# EAGLE design HW2 (EAGLE 7.5.0)
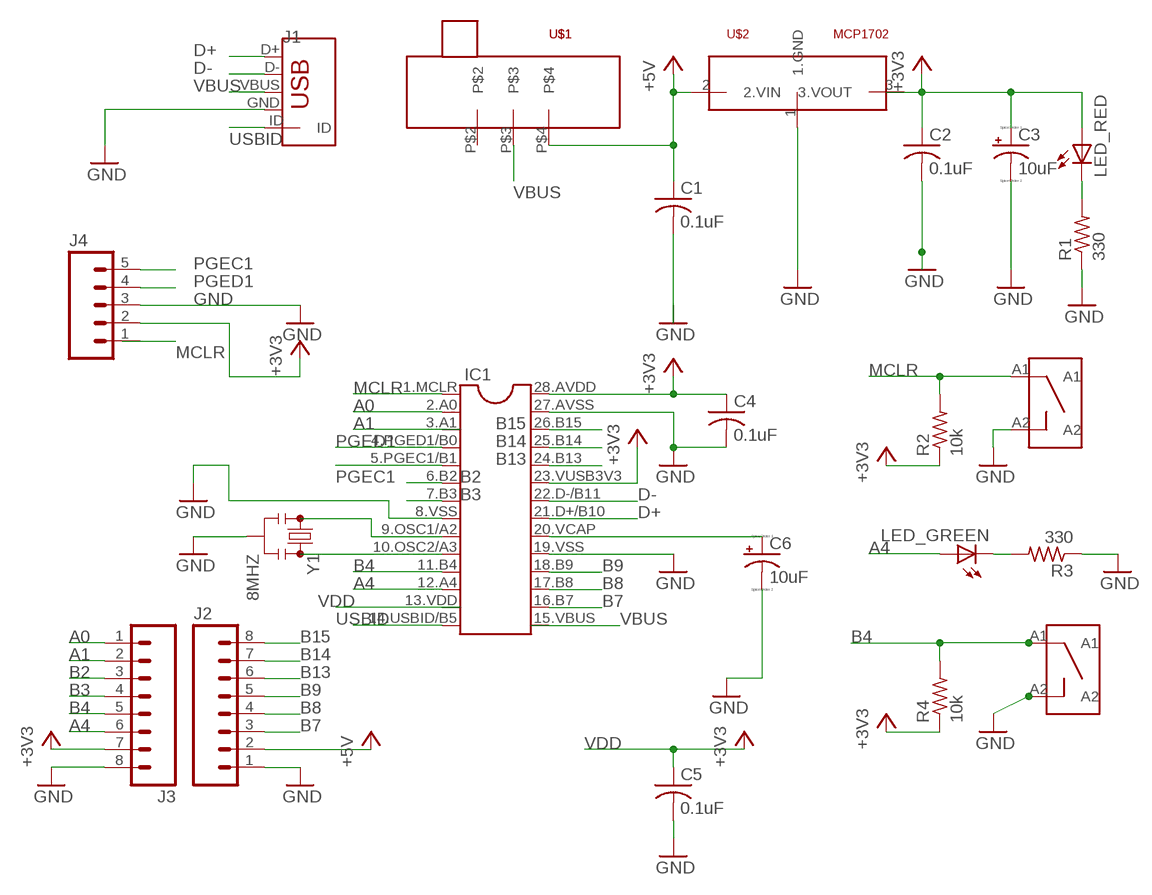
[diagram p0: schematic, sheet 1]

## Parts
C1  0.1uF  C-US025-024X044  [C025-024X044]
C2  0.1uF  C-US025-024X044  [C025-024X044]
C3  10uF  CPOL-USB45181A  [B45181A]
C4  0.1uF  C-US025-024X044  [C025-024X044]
C5  0.1uF  C-US025-024X044  [C025-024X044]
C6  10uF  CPOL-USB45181A  [B45181A]
IC1  DIL28-3  [DIL28-3]
J1  USB-MB-H  [USB-MB-H]
J2  M08  [1X08_ROUND]
J3  M08  [1X08_ROUND]
J4  M05PTH  [1X05]
LED_GREEN  LED3MM  [LED3MM]
LED_RED  LED3MM  [LED3MM]
R1  330  R-US_0207/10  [0207/10]
R2  10k  R-US_0207/10  [0207/10]
R3  330  R-US_0207/10  [0207/10]
R4  10k  R-US_0207/10  [0207/10]
U$1  SLIDE_SWITCH  [SLIDE_SWITCH]
U$2  MCP1702  [TO92]
U$4  PUSH_BUTTON  [RDT1034]
U$5  PUSH_BUTTON  [RDT1034]
Y1  8MHZ  RESONATORPTH  [RESONATOR-PTH]

## Nets
+3V3: C2.1 C3.+ C4.1 IC1.23.VUSB3V3 IC1.28.AVDD J3.7 J4.2 LED_RED.A R2.1 R4.1
+5V: C1.1 J2.2 U$1.P$4 U$2.2(2.VIN)
A0: IC1.2.A0 J3.1
A1: J3.2
A4: IC1.12.A4 J3.6 LED_GREEN.A
B2: IC1.6.B2 J3.3
B3: IC1.7.B3 J3.4
B4: IC1.11.B4 J3.5 R4.2 U$4.A1
B7: IC1.16.B7 J2.3
B8: IC1.17.B8 J2.4
B9: IC1.18.B9 J2.5
B13: IC1.24.B13 J2.6
B14: IC1.25.B14 J2.7
B15: IC1.26.B15 J2.8
D+: IC1.21.D+/B10 J1.D+
D-: IC1.22.D-/B11 J1.D-
GND: C2.2 C3.- C4.2 C5.2 C6.- IC1.8.VSS IC1.19.VSS IC1.27.AVSS J1.GND J2.1 J3.8 J4.3 R1.1 R3.1 U$2.1(1.GND) U$4.A2 U$5.A2 Y1.2
MCLR: IC1.1.MCLR R2.2 U$5.A1
N$1: LED_GREEN.K(C) R3.2
N$2: IC1.9.OSC1/A2 Y1.1
N$4: LED_RED.K(C) R1.2
N$5: IC1.10.OSC2/A3 Y1.3
N$6: C1.2
N$7: C6.+ IC1.20.VCAP
PGEC1: IC1.5.PGEC1/B1 J4.5
PGED1: IC1.4.PGED1/B0 J4.4
USBID: IC1.14.USBID/B5 J1.ID
VBUS: J1.VBUS U$1.P$3
VDD: C5.1 ; supply symbol labelled +3V3
Unconnected: IC1.3.A1 IC1.13.VDD IC1.15.VBUS J4.1 U$1.P$2 U$2.3(3.VOUT)

## Library data of the parts
C1 C2 C4 C5 = HW2:C-US: CAPACITOR, American symbol
C3 C6 = HW2:CPOL-US: POLARIZED CAPACITOR, American symbol
IC1 = HW2:DIL28: Dual In Line
J1 = HW2:USB: USB Connectors USB-B-PTH is fully proven SKU : PRT-00139/CONN-08278 USB-miniB is fully proven SKU : PRT-00587 USB-A-PCB is untested. USB-A-H is throughly reviewed, but untested. Spark Fun Electronics SKU : PRT-00437 USB-B-SMT is throughly reviewed, but untested. Needs silkscreen touching up. USB-A-S has not been used/tested USB-MB-H has not been used/tested USB-MICROB has been used. CONN-09505
J2 J3 = HW2:M08: Header 8 Standard 8-pin 0.1" header. Use with straight break away headers (SKU : PRT-00116), right angle break away headers (PRT-00553), swiss pins (PRT-00743), machine pins (PRT-00117), and female headers (PRT-00115).; PROD_ID: CONN-08437
J4 = HW2:M05: Header 5 Standard 5-pin 0.1" header. Use with straight break away headers (SKU : PRT-00116), right angle break away headers (PRT-00553), swiss pins (PRT-00743), machine pins (PRT-00117), and female headers (PRT-00115). Molex polarized connector foot print use with SKU : PRT-08230 with associated crimp pins and housings.
LED_GREEN LED_RED = HW2:LED: LED OSRAM: - CHIPLED LG R971, LG N971, LY N971, LG Q971, LY Q971, LO R971, LY R971 LH N974, LH R974 LS Q976, LO Q976, LY Q976 LO Q996 - Hyper CHIPLED LW Q18S LB Q993, LB Q99A, LB R99A - SideLED LS A670, LO A670, LY A670, LG A670, LP A670 LB A673, LV A673, LT A673, LW A673 LH A674 LY A675 LS A676, LA A676, LO A676, LY A676, LW A676 LS A679, LY A679, LG A679 - Hyper Micro SIDELED® LS Y876, LA Y876, LO Y876, LY Y876 LT Y87S - SmartLED LW L88C, LW L88S LB L89C, LB L89S, LG L890 LS L89K, LO L89K, LY L89K LS L896, LA L896, LO L896, LY L896 - TOPLED LS T670, LO T670, LY T670, LG T670, LP T670 LSG T670, LSP T670, LSY T670, LOP T670, LYG T670 LG T671, LOG T671, LSG T671 LB T673, LV T673, LT T673, LW T673 LH T674 LS T676, LA T676, LO T676, LY T676, LB T676, LH T676, LSB T676, LW T676 LB T67C, LV T67C, LT T67C, LS T67K, LO T67K, LY T67K, LW E67C LS E67B, LA E67B, LO E67B, LY E67B, LB E67C, LV E67C, LT E67C LW T67C LS T679, LY T679, LG T679 LS T770, LO T770, LY T770, LG T770, LP T770 LB T773, LV T773, LT T773, LW T773 LH T774 LS E675, LA E675, LY E675, LS T675 LS T776, LA T776, LO T776, LY T776, LB T776 LHGB T686 LT T68C, LB T68C - Hyper Mini TOPLED® LB M676 - Mini TOPLED Santana® LG M470 LS M47K, LO M47K, LY M47K Source: http://www.osram.convergy.de LUXEON: - LUMILED® LXK2-PW12-R00, LXK2-PW12-S00, LXK2-PW14-U00, LXK2-PW14-V00 LXK2-PM12-R00, LXK2-PM12-S00, LXK2-PM14-U00 LXK2-PE12-Q00, LXK2-PE12-R00, LXK2-PE12-S00, LXK2-PE14-T00, LXK2-PE14-U00 LXK2-PB12-K00, LXK2-PB12-L00, LXK2-PB12-M00, LXK2-PB14-N00, LXK2-PB14-P00, LXK2-PB14-Q00 LXK2-PR12-L00, LXK2-PR12-M00, LXK2-PR14-Q00, LXK2-PR14-R00 LXK2-PD12-Q00, LXK2-PD12-R00, LXK2-PD12-S00 LXK2-PH12-R00, LXK2-PH12-S00 LXK2-PL12-P00, LXK2-PL12-Q00, LXK2-PL12-R00 Source: www.luxeon.com KINGBRIGHT: KA-3528ASYC Source: www.kingbright.com
R1-R4 = HW2:R-US_: RESISTOR, American symbol
U$1 = HW2:SLIDE_SWITCH
U$2 = HW2:MCP1702
U$4 U$5 = HW2:PUSH_BUTTON
Y1 = HW2:RESONATOR: Resonator Small SMD resonator. Used, eg, on the Arduino Pro/ Pro Mini boards. 8MHz- XTAL-08895 16MHz- XTAL-08900

## Board
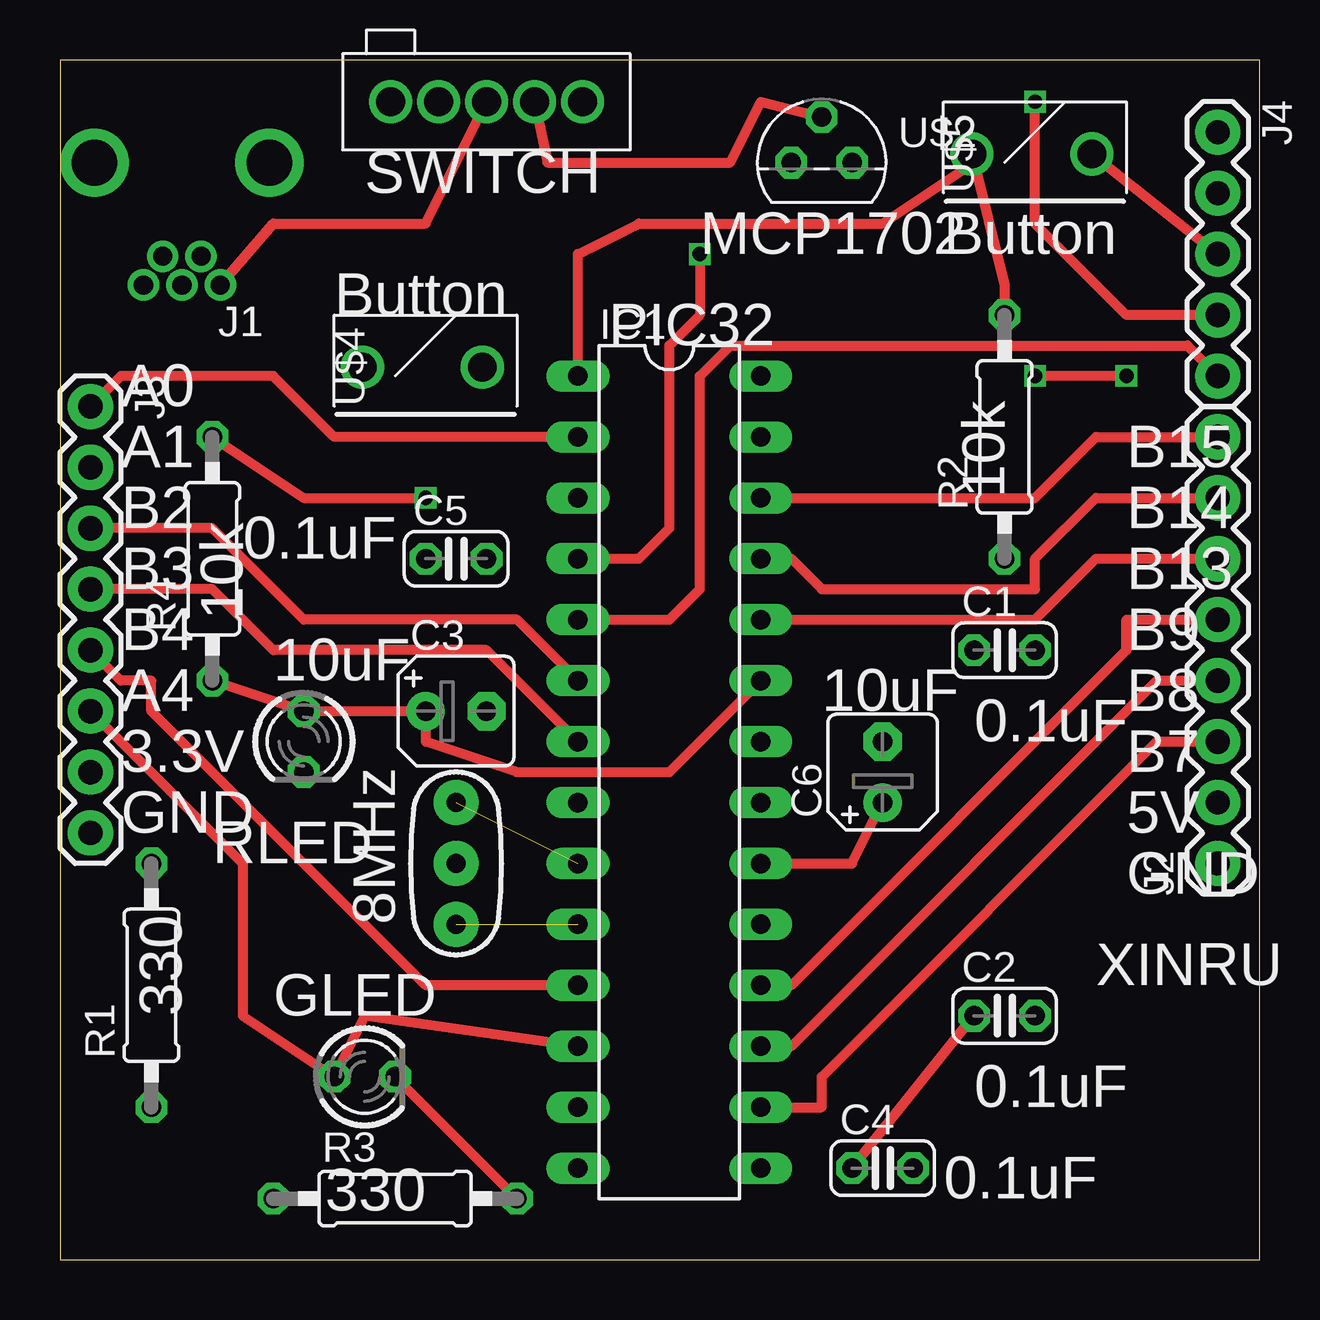
[diagram p1: board, top side]
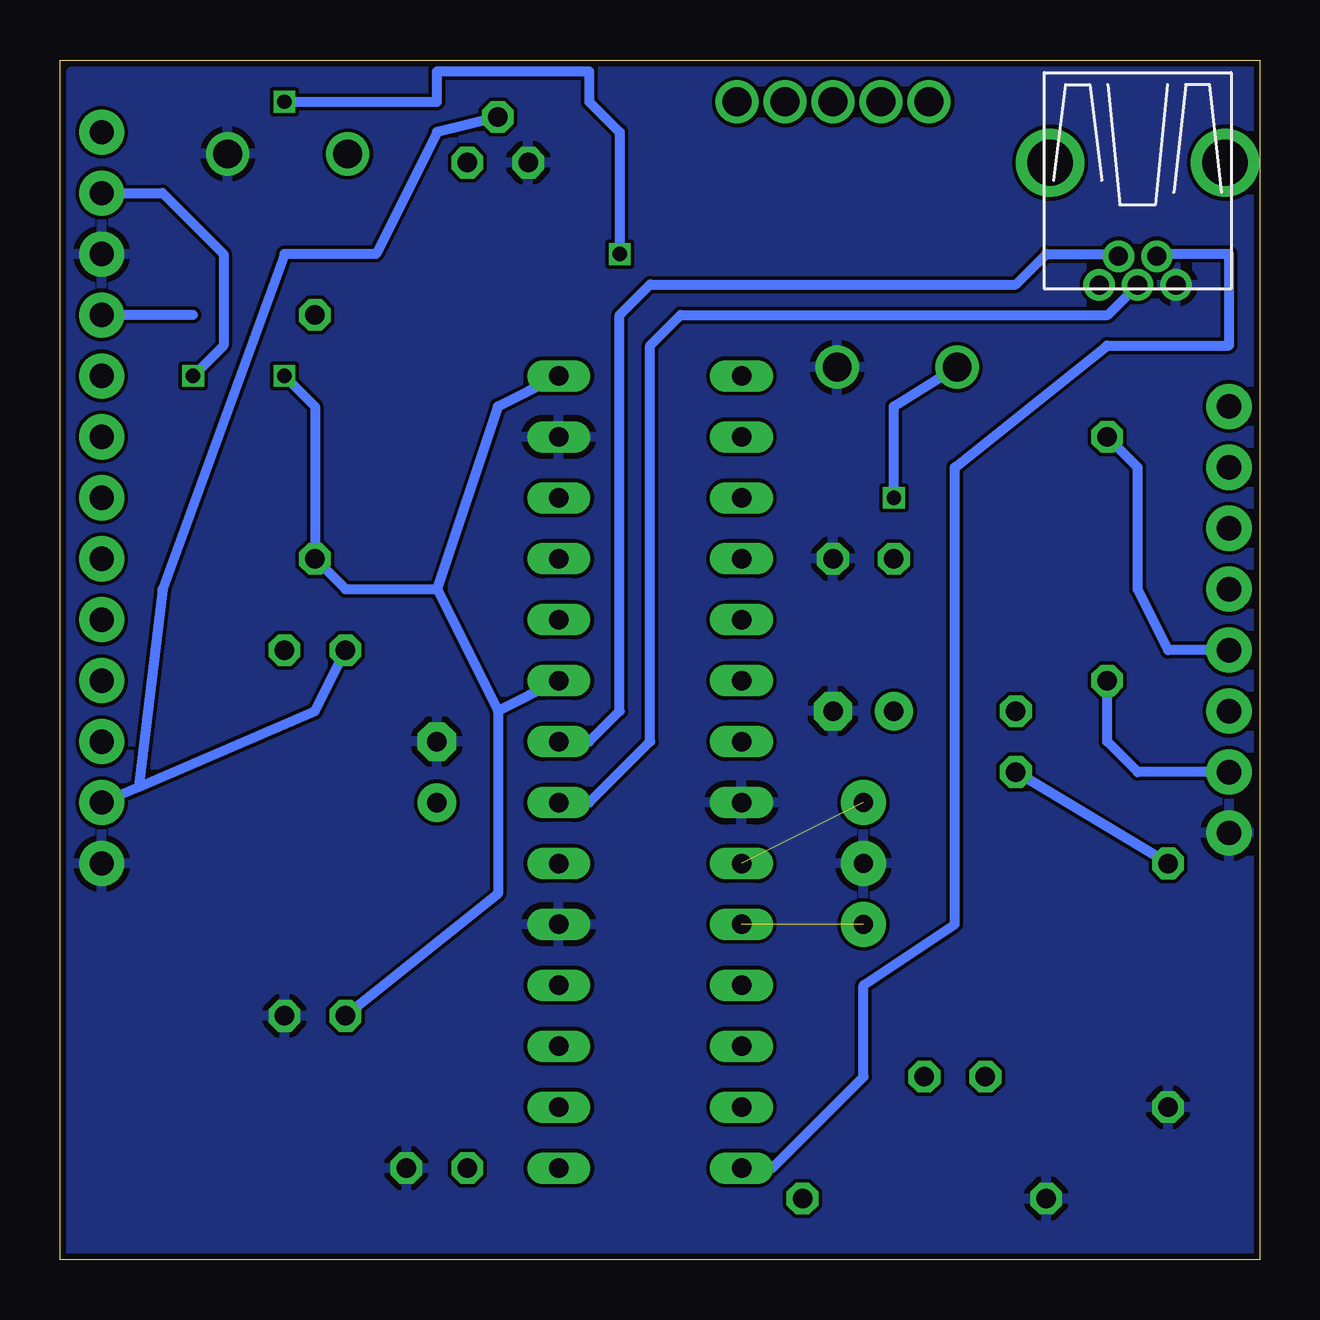
[diagram p2: board, bottom side, seen from below]

Size 50 x 50 mm. Coordinates in mm from the lower left corner, seen from the top.
Outline: 0,0 50,0 50,50 0,50 0,0
Copper layers (1*16): Top 0.035mm / dielectric 1.5mm / Bottom 0.035mm
Design rules "SeeedStudio_2layer_DRU_no_angle_20140221": minimum track width 6mil, minimum drill 12mil, track to track 6mil, track to pad 6mil, pad to pad 6mil, via to via 6mil, smd to smd 0mil, copper to edge 10mil, drill to drill 10mil, minimum pad ring 10mil, minimum via ring 6mil, stop-mask expansion 2mil, vias tented up to drill 100mil, thermal gap 10mil

### Footprints (pad centres in the part's own frame; a part is rotated, then mirrored left to right if it is on the bottom)
C025-024X044 = drill 0.813 octagon: 1 -1.27,0; 2 1.27,0
B45181A = drill 0.813 pad 1.6: + -1.27,0 | drill 0.813 pad 1.6 octagon: - 1.27,0
DIL28-3 = drill 0.813 long: 1.MCLR -16.51,-3.81; 2.A0 -13.97,-3.81; 3.A1 -11.43,-3.81; 4.PGED1/B0 -8.89,-3.81; 5.PGEC1/B1 -6.35,-3.81; 6.B2 -3.81,-3.81; 7.B3 -1.27,-3.81; 8.VSS 1.27,-3.81; 9.OSC1/A2 3.81,-3.81; 10.OSC2/A3 6.35,-3.81; 11.B4 8.89,-3.81; 12.A4 11.43,-3.81; 13.VDD 13.97,-3.81; 14.USBID/B5 16.51,-3.81; 15.VBUS 16.51,3.81; 16.B7 13.97,3.81; 17.B8 11.43,3.81; 18.B9 8.89,3.81; 19.VSS 6.35,3.81; 20.VCAP 3.81,3.81; 21.D+/B10 1.27,3.81; 22.D-/B11 -1.27,3.81; 23.VUSB3V3 -3.81,3.81; 24.B13 -6.35,3.81; 25.B14 -8.89,3.81; 26.B15 -11.43,3.81; 27.AVSS -13.97,3.81; 28.AVDD -16.51,3.81
USB-MB-H = drill 0.8: D+ 5.1,0; D- 3.9,0.8; GND 5.1,-1.6; ID 3.9,-0.8; VBUS 5.1,1.6 | drill 1.9: P$6 0,-3.65; P$7 0,3.65
1X08_ROUND = drill 1.016 pad 1.88: 1 0,0; 2 2.54,0; 3 5.08,0; 4 7.62,0; 5 10.16,0; 6 12.7,0; 7 15.24,0; 8 17.78,0
1X05 = drill 1.016 pad 1.88: 1 0,0; 2 2.54,0; 3 5.08,0; 4 7.62,0; 5 10.16,0
LED3MM = drill 0.813 octagon: A -1.27,0; K 1.27,0
0207/10 = drill 0.813 octagon: 1 -5.08,0; 2 5.08,0
SLIDE_SWITCH = drill 1.2: P$1 -4,0; P$2 -2,0; P$3 0,0; P$4 2,0; P$5 4,0
TO92 = drill 0.813 octagon: 1 -1.27,0; 2 0,1.905; 3 1.27,0
RDT1034 = drill 1.2: A1 -2.175,2.635; A2 -2.175,-2.365
RESONATOR-PTH = drill 0.8 pad 1.88: 1 -2.54,0; 2 0,0; 3 2.54,0

### Placement (x,y rotation side)
C1  39.37,25.4 0 top
C2  39.37,10.16 0 top
C3  16.51,22.86 0 top
C4  34.29,3.81 0 top
C5  16.51,29.21 0 top
C6  34.29,20.32 90 top
IC1  25.4,20.32 270 top
J1  5.08,45.72 270 top
J2  48.26,16.51 90 top
J3  1.27,35.56 270 top
J4  48.26,46.99 270 top
LED_GREEN  12.7,7.62 0 top
LED_RED  10.16,21.59 270 top
R1  3.81,11.43 90 top
R2  39.37,34.29 90 top
R3  13.97,2.54 0 top
R4  6.35,29.21 90 top
U$1  17.78,48.26 0 top
U$2  31.75,45.72 0 top
U$4  15.24,39.37 90 top
U$5  40.64,48.26 90 top
Y1  16.51,16.51 270 top

### Tracks (layer width: path | path; a pad name or v marks a point on that pad's centre or on a via)
+3V3  (via drill 0.6)
  Top 0.406: R4.1 LED_RED.A C3.+ 15.24,21.59 19.05,20.32 25.4,20.32 IC1.23.VUSB3V3 | C4.1 C2.1 | v44.45,36.83 v40.64,36.83
  Bottom 0.406: J3.7 5.08,20.32 6.35,21.59 R4.1 | IC1.23.VUSB3V3 31.75,22.86 | 31.75,22.86 31.75,15.24 C2.1 | 34.29,27.94 38.1,27.94 R2.1 39.37,35.56 v40.64,36.83 | 34.29,27.94 31.75,22.86 | IC1.28.AVDD 31.75,35.56 34.29,27.94 | J4.2 45.72,44.45 43.18,41.91 43.18,38.1 v44.45,36.83
+5V
  Top 0.406: U$1.P$4 20.32,45.72 27.94,45.72 29.21,48.26 U$2.2
  Bottom 0.406: J2.2 46.73,19.71 | 46.73,19.71 39.37,22.86 C1.1 | U$2.2 34.29,46.99 36.83,41.91 40.64,41.91 45.72,27.94 46.73,19.71
A0
  Top 0.406: IC1.2.A0 11.43,34.29 8.89,36.83 2.54,36.83 J3.1
A4
  Top 0.406: J3.6 7.62,16.51 7.62,10.16 LED_GREEN.A 12.7,10.16 IC1.12.A4
B2
  Top 0.406: IC1.6.B2 19.05,26.67 10.16,26.67 6.35,30.48 J3.3
B3
  Top 0.406: IC1.7.B3 17.78,25.4 8.89,25.4 6.35,27.94 J3.4
B4  (via drill 0.6)
  Top 0.406: IC1.11.B4 15.24,11.43 3.81,22.86 3.81,24.13 2.54,24.13 J3.5 | R4.2 10.16,31.75 v15.24,31.75
  Bottom 0.406: J3.5 3.81,25.4 5.08,27.94 5.08,33.02 R4.2 | v15.24,31.75 15.24,35.56 U$4.A1
B7
  Top 0.406: IC1.16.B7 31.75,6.35 31.75,7.62 45.72,21.59 J2.3
B8
  Top 0.406: IC1.17.B8 30.48,8.89 45.72,24.13 J2.4
B9
  Top 0.406: IC1.18.B9 30.48,11.43 44.45,25.4 44.45,26.67 J2.5
B13
  Top 0.406: IC1.24.B13 40.64,26.67 43.18,29.21 J2.6
B14
  Top 0.406: J2.7 43.18,31.75 40.64,29.21 40.64,27.94 31.75,27.94 30.48,29.21 IC1.25.B14
B15
  Top 0.406: IC1.26.B15 40.64,31.75 43.18,34.29 J2.8
D+
  Bottom 0.406: IC1.21.D+/B10 27.94,19.05 25.4,21.59 25.4,38.1 24.13,39.37 6.33,39.37 J1.D+
D-
  Bottom 0.406: IC1.22.D-/B11 27.94,21.59 26.67,22.86 26.67,39.37 25.4,40.64 10.16,40.64 8.89,41.91 5.97,41.91 J1.D-
GND
  Top 0.406: U$5.A2 J4.3
  pour Bottom: 0,49.53 0,0 49.53,0 49.53,49.53 0,49.53
MCLR
  Top 0.406: R2.2 39.37,40.64 U$5.A1 38.1,45.72 34.29,43.18 24.13,43.18 21.59,41.91 IC1.1.MCLR
N$1
  Top 0.406: LED_GREEN.K R3.2
N$2  (1 unrouted)
N$4
  Bottom 0.406: R1.2 LED_RED.K
N$5  (1 unrouted)
N$7
  Top 0.406: IC1.20.VCAP 33.02,16.51 C6.+
PGEC1
  Top 0.406: IC1.5.PGEC1/B1 25.4,26.67 26.67,27.94 26.67,36.83 27.94,38.1 46.99,38.1 J4.5
PGED1  (via drill 0.6)
  Top 0.406: IC1.4.PGED1/B0 24.13,29.21 25.4,30.48 25.4,38.1 26.67,39.37 v26.67,41.91 | J4.4 44.45,39.37 40.64,43.18 v40.64,48.26
  Bottom 0.406: 44.45,39.37 J4.4 | v26.67,41.91 26.67,46.99 27.94,48.26 27.94,49.53 34.29,49.53 34.29,48.26 v40.64,48.26
USBID
  Bottom 0.406: IC1.14.USBID/B5 20.32,3.81 16.51,7.62 16.51,11.43 12.7,13.97 12.7,33.02 6.35,38.1 1.27,38.1 1.27,41.91 3.81,41.91 J1.ID
VBUS
  Top 0.406: J1.VBUS 8.89,43.18 15.24,43.18 U$1.P$3

### Text on the board
tPlace: SWITCH | MCP1702 | Button | Button | PIC32 | A0 | A1 | B15 | 10k | B2 | B14 | 0.1uF | B3 | B13 | 10k | B4 | B9 | 10uF | A4 | 10uF | B8 | 0.1uF | 3.3V | B7 | GND | 5V | RLED | GND | 8MHz | XINRU | 330 | GLED | 0.1uF | 330 | 0.1uF